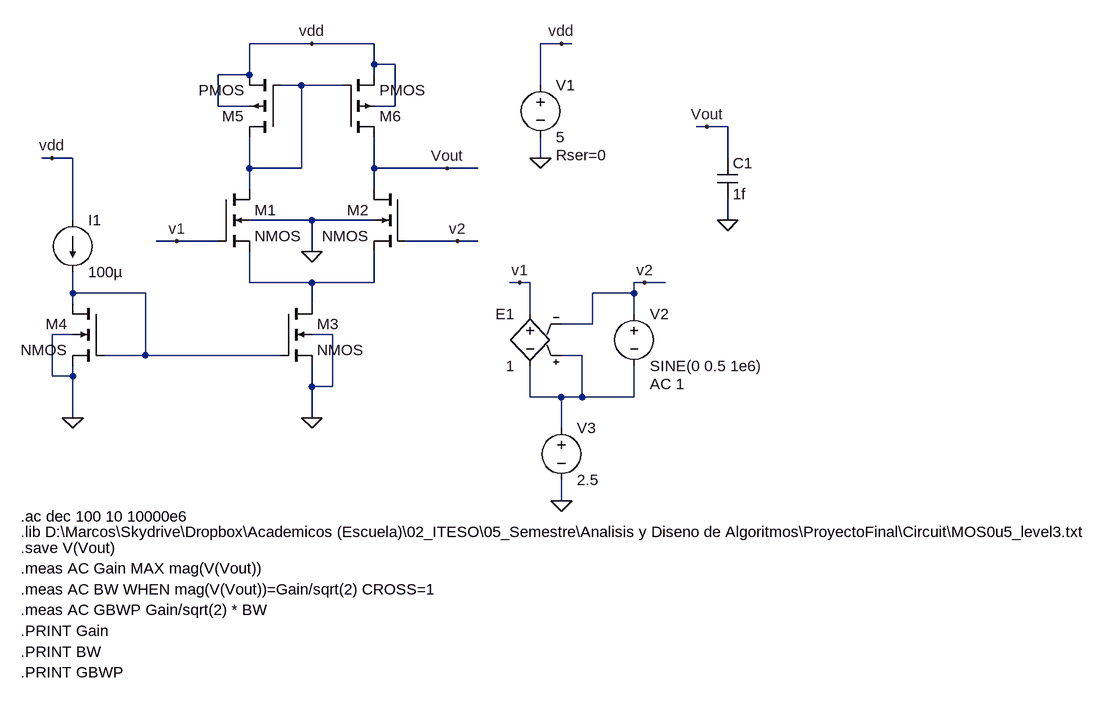
[diagram p0: schematic OTA_Basic.asc]
OTA_Basic.asc, the LTspice schematic file:
Version 4
SHEET 1 1468 872
WIRE 192 -112 96 -112
WIRE 288 -112 192 -112
WIRE 576 -112 544 -112
WIRE 592 -112 576 -112
WIRE 288 -80 288 -112
WIRE 320 -80 288 -80
WIRE 96 -64 96 -112
WIRE 96 -64 48 -64
WIRE 288 -64 288 -80
WIRE 176 -48 144 -48
WIRE 240 -48 176 -48
WIRE 544 -48 544 -112
WIRE 48 -16 48 -64
WIRE 96 -16 48 -16
WIRE 320 -16 320 -80
WIRE 320 -16 288 -16
WIRE 800 16 784 16
WIRE 832 16 800 16
WIRE -208 64 -224 64
WIRE -176 64 -208 64
WIRE 544 64 544 32
WIRE 832 64 832 16
WIRE 96 80 96 32
WIRE 176 80 176 -48
WIRE 176 80 96 80
WIRE 288 80 288 32
WIRE 400 80 288 80
WIRE 448 80 400 80
WIRE 96 112 96 80
WIRE 288 112 288 80
WIRE -176 160 -176 64
WIRE 192 160 96 160
WIRE 288 160 192 160
WIRE 832 160 832 128
WIRE -16 192 -48 192
WIRE 48 192 -16 192
WIRE 416 192 336 192
WIRE 448 192 416 192
WIRE 192 208 192 160
WIRE 96 256 96 208
WIRE 192 256 96 256
WIRE 288 256 288 208
WIRE 288 256 192 256
WIRE 512 256 496 256
WIRE 528 256 512 256
WIRE 704 256 688 256
WIRE 736 256 704 256
WIRE -176 272 -176 240
WIRE -64 272 -176 272
WIRE 688 272 688 256
WIRE 688 272 624 272
WIRE -176 288 -176 272
WIRE 192 288 192 256
WIRE 528 304 528 256
WIRE 688 304 688 272
WIRE 624 320 624 272
WIRE 624 320 576 320
WIRE -176 336 -208 336
WIRE 224 336 192 336
WIRE -64 368 -64 272
WIRE -64 368 -128 368
WIRE 144 368 -64 368
WIRE 608 368 576 368
WIRE -208 400 -208 336
WIRE -176 400 -176 384
WIRE -176 400 -208 400
WIRE 192 416 192 384
WIRE 224 416 224 336
WIRE 224 416 192 416
WIRE 528 432 528 384
WIRE 576 432 528 432
WIRE 608 432 608 368
WIRE 608 432 576 432
WIRE 688 432 688 384
WIRE 688 432 608 432
WIRE -176 464 -176 400
WIRE 192 464 192 416
WIRE 576 480 576 432
WIRE 576 592 576 560
FLAG 192 464 0
FLAG -176 464 0
FLAG 544 64 0
FLAG 576 -112 vdd
FLAG 192 -112 vdd
FLAG 400 80 Vout
FLAG 416 192 v2
FLAG -16 192 v1
FLAG 576 592 0
FLAG 512 256 v1
FLAG 704 256 v2
FLAG -208 64 vdd
FLAG 832 160 0
FLAG 800 16 Vout
FLAG 192 208 0
SYMBOL current -176 160 R0
WINDOW 123 0 0 Left 0
WINDOW 39 0 0 Left 0
SYMATTR InstName I1
SYMATTR Value 100µ
SYMBOL voltage 544 -64 R0
WINDOW 123 0 0 Left 0
WINDOW 39 24 124 Left 2
SYMATTR SpiceLine Rser=0
SYMATTR InstName V1
SYMATTR Value 5
SYMBOL voltage 688 288 R0
WINDOW 123 24 124 Left 2
WINDOW 39 0 0 Left 0
SYMATTR Value2 AC 1
SYMATTR InstName V2
SYMATTR Value SINE(0 0.5 1e6)
SYMBOL e2 528 288 M0
SYMATTR InstName E1
SYMATTR Value 1
SYMBOL voltage 576 464 R0
WINDOW 123 0 0 Left 0
WINDOW 39 0 0 Left 0
SYMATTR InstName V3
SYMATTR Value 2.5
SYMBOL cap 816 64 R0
SYMATTR InstName C1
SYMATTR Value 1f
SYMBOL nmos4 48 112 R0
SYMATTR InstName M1
SYMATTR Value2 l=1.2u w=22.3814619317u
SYMBOL nmos4 336 112 M0
SYMATTR InstName M2
SYMATTR Value2 l=1.2u w=22.3814619317u
SYMBOL nmos4 144 288 R0
SYMATTR InstName M3
SYMATTR Value2 l=1.2u w=109.08u
SYMBOL nmos4 -128 288 M0
SYMATTR InstName M4
SYMATTR Value2 l=1.2u w=109.08u
SYMBOL pmos4 144 32 R180
SYMATTR InstName M5
SYMATTR Value2 l=1.2u w=1.2638109054u
SYMBOL pmos4 240 32 M180
SYMATTR InstName M6
SYMATTR Value2 l=1.2u w=1.2638109054u
TEXT -256 616 Left 2 !.ac dec 100 10 10000e6
TEXT -256 640 Left 2 !.lib D:\\Marcos\\Skydrive\\Dropbox\\Academicos (Escuela)\\02_ITESO\\05_Semestre\\Analisis y Diseno de Algoritmos\\ProyectoFinal\\Circuit\\MOS0u5_level3.txt
TEXT -256 696 Left 2 !.meas AC Gain MAX mag(V(Vout))
TEXT -256 792 Left 2 !.PRINT Gain
TEXT -256 664 Left 2 !.save V(Vout)
TEXT -256 728 Left 2 !.meas AC BW WHEN mag(V(Vout))=Gain/sqrt(2) CROSS=1
TEXT -256 824 Left 2 !.PRINT BW
TEXT -256 760 Left 2 !.meas AC GBWP Gain/sqrt(2) * BW
TEXT -256 856 Left 2 !.PRINT GBWP

The netlist it stands for:
* OTA_Basic.asc
I1 vdd N003 100µ
V1 vdd 0 5 Rser=0
V2 v2 N004 SINE(0 0.5 1e6) AC 1
E1 v1 N004 N004 v2 1
V3 N004 0 2.5
C1 Vout 0 1f
M1 N001 v1 N002 0 NMOS l=1.2u w=22.3814619317u
M2 Vout v2 N002 0 NMOS l=1.2u w=22.3814619317u
M3 N002 N003 0 0 NMOS l=1.2u w=109.08u
M4 N003 N003 0 0 NMOS l=1.2u w=109.08u
M5 N001 N001 vdd vdd PMOS l=1.2u w=1.2638109054u
M6 Vout N001 vdd vdd PMOS l=1.2u w=1.2638109054u
.model NMOS NMOS
.model PMOS PMOS
.lib standard.mos
.ac dec 100 10 10000e6
.lib D:\Marcos\Skydrive\Dropbox\Academicos (Escuela)\02_ITESO\05_Semestre\Analisis y Diseno de Algoritmos\ProyectoFinal\Circuit\MOS0u5_level3.txt
.meas AC Gain MAX mag(V(Vout))
.PRINT Gain
.save V(Vout)
.meas AC BW WHEN mag(V(Vout))=Gain/sqrt(2) CROSS=1
.PRINT BW
.meas AC GBWP Gain/sqrt(2) * BW
.PRINT GBWP
.backanno
.end